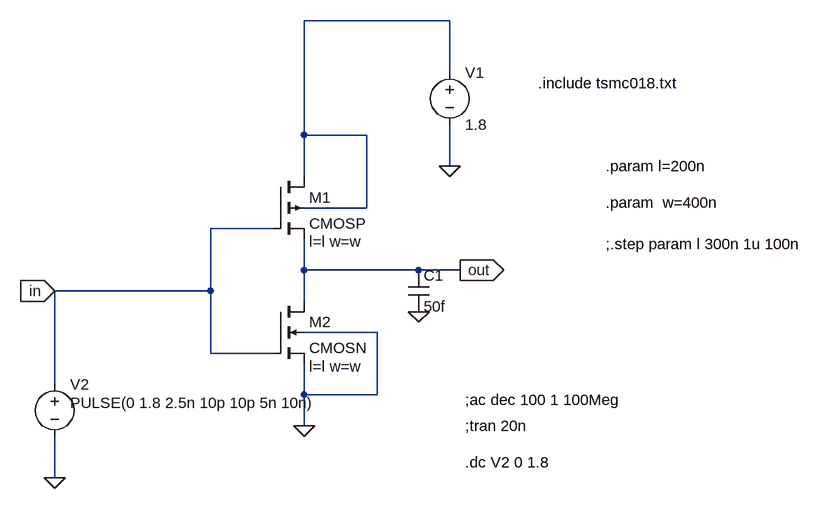
[diagram p0: schematic cmos inverter.asc]
cmos inverter.asc, the LTspice schematic file:
Version 4
SHEET 1 988 1080
WIRE 416 336 192 336
WIRE 416 416 416 336
WIRE 192 512 192 336
WIRE 288 512 192 512
WIRE 416 560 416 496
WIRE 192 576 192 512
WIRE 288 624 288 512
WIRE 288 624 192 624
WIRE 144 656 48 656
WIRE 192 720 192 672
WIRE 368 720 192 720
WIRE 432 720 368 720
WIRE 48 752 48 656
WIRE 48 752 -192 752
WIRE 192 768 192 720
WIRE 304 816 192 816
WIRE 48 848 48 752
WIRE 144 848 48 848
WIRE -192 896 -192 752
WIRE 192 912 192 864
WIRE 304 912 304 816
WIRE 304 912 192 912
WIRE 192 960 192 912
WIRE -192 1040 -192 976
FLAG 416 560 0
FLAG 192 960 0
FLAG -192 1040 0
FLAG 432 720 out
IOPIN 432 720 Out
FLAG -192 752 in
IOPIN -192 752 In
FLAG 368 784 0
SYMBOL pmos4 144 576 R0
WINDOW 123 56 100 Left 2
SYMATTR Value2 l=l w=w
SYMATTR InstName M1
SYMATTR Value CMOSP
SYMBOL nmos4 144 768 R0
WINDOW 123 56 100 Left 2
SYMATTR Value2 l=l w=w
SYMATTR InstName M2
SYMATTR Value CMOSN
SYMBOL voltage 416 400 R0
WINDOW 123 0 0 Left 0
WINDOW 39 0 0 Left 0
SYMATTR InstName V1
SYMATTR Value 1.8
SYMBOL voltage -192 880 R0
WINDOW 3 24 44 Left 2
WINDOW 123 24 72 Left 2
WINDOW 39 0 0 Left 0
SYMATTR Value PULSE(0 1.8 2.5n 10p 10p 5n 10n)
SYMATTR InstName V2
SYMBOL cap 352 720 R0
SYMATTR InstName C1
SYMATTR Value 50f
TEXT 440 960 Left 2 !;tran 20n
TEXT 552 432 Left 2 !.include tsmc018.txt
TEXT 440 1016 Left 2 !.dc V2 0 1.8
TEXT 440 920 Left 2 !;ac dec 100 1 100Meg
TEXT 656 560 Left 2 !.param l=200n
TEXT 656 616 Left 2 !.param  w=400n
TEXT 656 680 Left 2 !;.step param l 300n 1u 100n

The netlist it stands for:
* cmos inverter.asc
M1 N001 in out N001 CMOSP l=l w=w
M2 out in 0 0 CMOSN l=l w=w
V1 N001 0 1.8
V2 in 0 PULSE(0 1.8 2.5n 10p 10p 5n 10n)
C1 out 0 50f
.model NMOS NMOS
.model PMOS PMOS
.lib standard.mos
;tran 20n
.include tsmc018.txt
.dc V2 0 1.8
;ac dec 100 1 100Meg
.param l=200n
.param  w=400n
;.step param l 300n 1u 100n
.backanno
.end